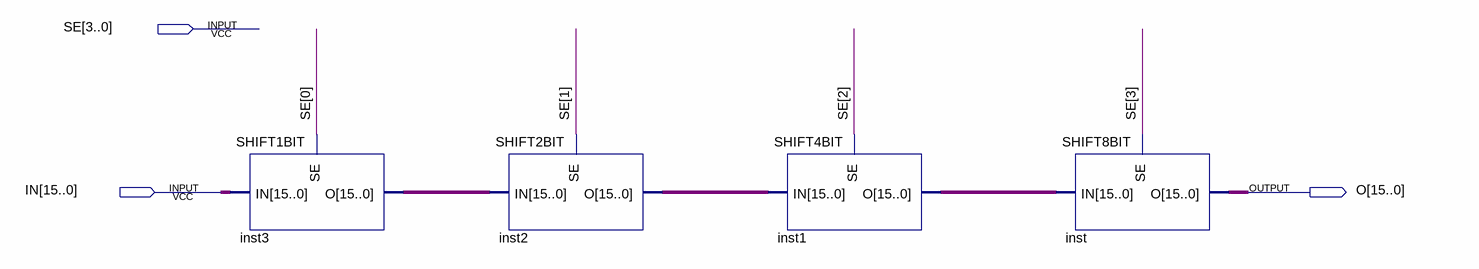
[diagram p0: schematic sheet]
// Quartus schematic SHIFT16BIT.bdf as structural Verilog: 4 symbols, 3 pins
module SHIFT16BIT (
  input  [3:0] SE,
  input  [15:0] IN,
  output [15:0] O
);

  wire [15:0] inst1_o, inst2_o, inst3_o;

  SHIFT1BIT inst3 (.SE(SE[0]), .IN(IN), .O(inst3_o));
  SHIFT2BIT inst2 (.SE(SE[1]), .IN(inst3_o), .O(inst2_o));
  SHIFT4BIT inst1 (.SE(SE[2]), .IN(inst2_o), .O(inst1_o));
  SHIFT8BIT inst (.SE(SE[3]), .IN(inst1_o), .O(O));
endmodule
